# EAGLE schematic biofeedback_2560_3V (EAGLE 6.0)
DATABASE: ./BOM/PARTSDB.txt

## Sheet 1 of 4
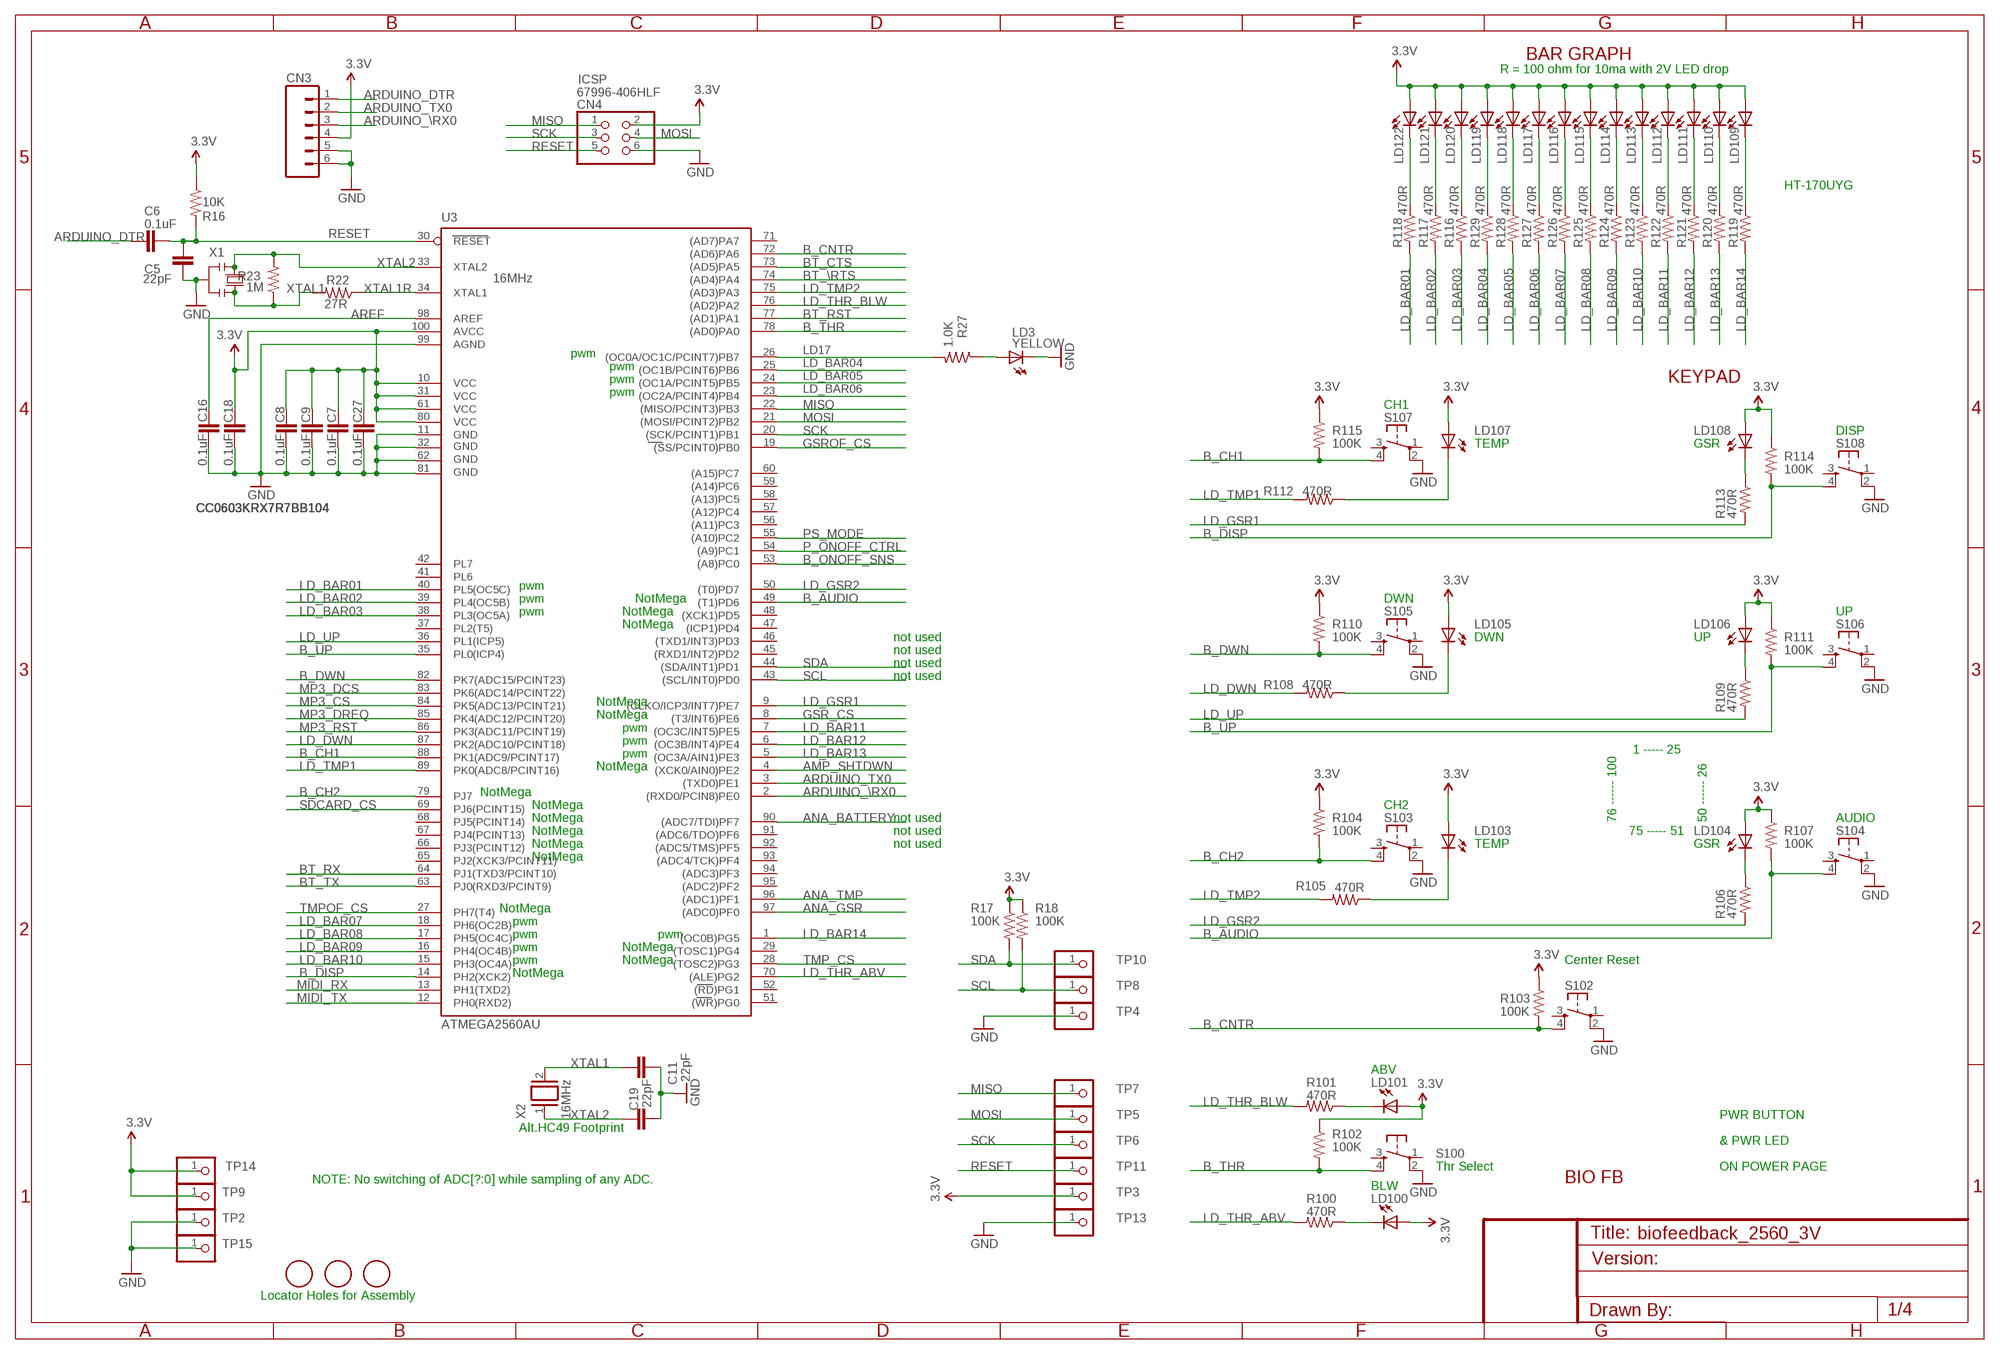
[diagram p0: schematic, sheet 1]

### Parts
C5  22pF  C-EUC0603  [C0603]
C6  0.1uF  C-EUC0603  [C0603]
C7  0.1uF  C-EUC0603  [C0603]
C8  0.1uF  C-EUC0603  [C0603]
C9  0.1uF  C-EUC0603  [C0603]
C11  22pF  C-EUC0603  [C0603]
C16  0.1uF  C-EUC0603  [C0603]
C18  0.1uF  C-EUC0603  [C0603]
C19  22pF  C-EUC0603  [C0603]
C27  0.1uF  C-EUC0603  [C0603]
CN3  NSTUFF  M06SIP  [1X06]
CN4  ICSP  PINHD-2X3  [2X03]
LD3  YELLOW  LEDCHIP-LED0805  [CHIP-LED0805]
LD100  GREEN  LEDCHIP-LED0805  [CHIP-LED0805]
LD101  GREEN  LEDCHIP-LED0805  [CHIP-LED0805]
LD103  GREEN  LEDCHIP-LED0805  [CHIP-LED0805]
LD104  GREEN  LEDCHIP-LED0805  [CHIP-LED0805]
LD105  GREEN  LEDCHIP-LED0805  [CHIP-LED0805]
LD106  GREEN  LEDCHIP-LED0805  [CHIP-LED0805]
LD107  GREEN  LEDCHIP-LED0805  [CHIP-LED0805]
LD108  GREEN  LEDCHIP-LED0805  [CHIP-LED0805]
LD109  GREEN  LEDCHIP-LED0805  [CHIP-LED0805]
LD110  GREEN  LEDCHIP-LED0805  [CHIP-LED0805]
LD111  GREEN  LEDCHIP-LED0805  [CHIP-LED0805]
LD112  GREEN  LEDCHIP-LED0805  [CHIP-LED0805]
LD113  GREEN  LEDCHIP-LED0805  [CHIP-LED0805]
LD114  GREEN  LEDCHIP-LED0805  [CHIP-LED0805]
LD115  GREEN  LEDCHIP-LED0805  [CHIP-LED0805]
LD116  GREEN  LEDCHIP-LED0805  [CHIP-LED0805]
LD117  GREEN  LEDCHIP-LED0805  [CHIP-LED0805]
LD118  GREEN  LEDCHIP-LED0805  [CHIP-LED0805]
LD119  GREEN  LEDCHIP-LED0805  [CHIP-LED0805]
LD120  GREEN  LEDCHIP-LED0805  [CHIP-LED0805]
LD121  GREEN  LEDCHIP-LED0805  [CHIP-LED0805]
LD122  GREEN  LEDCHIP-LED0805  [CHIP-LED0805]
MN1  FIDUCIALMOUNT  [FIDUCIA-MOUNT]
MN2  FIDUCIALMOUNT  [FIDUCIA-MOUNT]
MN3  FIDUCIALMOUNT  [FIDUCIA-MOUNT]
R16  10K  R-US_R0603  [R0603]
R17  100K  R-US_R0603  [R0603]
R18  100K  R-US_R0603  [R0603]
R22  27R  R-US_R0603  [R0603]
R23  1M  R-US_R0603  [R0603]
R27  1.0K  R-US_R0603  [R0603]
R100  470R  R-US_R0603  [R0603]
R101  470R  R-US_R0603  [R0603]
R102  100K  R-US_R0603  [R0603]
R103  100K  R-US_R0603  [R0603]
R104  100K  R-US_R0603  [R0603]
R105  470R  R-US_R0603  [R0603]
R106  470R  R-US_R0603  [R0603]
R107  100K  R-US_R0603  [R0603]
R108  470R  R-US_R0603  [R0603]
R109  470R  R-US_R0603  [R0603]
R110  100K  R-US_R0603  [R0603]
R111  100K  R-US_R0603  [R0603]
R112  470R  R-US_R0603  [R0603]
R113  470R  R-US_R0603  [R0603]
R114  100K  R-US_R0603  [R0603]
R115  100K  R-US_R0603  [R0603]
R116  470R  R-US_R0603  [R0603]
R117  470R  R-US_R0603  [R0603]
R118  470R  R-US_R0603  [R0603]
R119  470R  R-US_R0603  [R0603]
R120  470R  R-US_R0603  [R0603]
R121  470R  R-US_R0603  [R0603]
R122  470R  R-US_R0603  [R0603]
R123  470R  R-US_R0603  [R0603]
R124  470R  R-US_R0603  [R0603]
R125  470R  R-US_R0603  [R0603]
R126  470R  R-US_R0603  [R0603]
R127  470R  R-US_R0603  [R0603]
R128  470R  R-US_R0603  [R0603]
R129  470R  R-US_R0603  [R0603]
S100  SPST-NO  TAC_SWITCH  [TACTILE_SWITCH_SMD_6MM_SQ]
S102  SPST-NO  TAC_SWITCH  [TACTILE_SWITCH_SMD_6MM_SQ]
S103  SPST-NO  TAC_SWITCH  [TACTILE_SWITCH_SMD_6MM_SQ]
S104  SPST-NO  TAC_SWITCH  [TACTILE_SWITCH_SMD_6MM_SQ]
S105  SPST-NO  TAC_SWITCH  [TACTILE_SWITCH_SMD_6MM_SQ]
S106  SPST-NO  TAC_SWITCH  [TACTILE_SWITCH_SMD_6MM_SQ]
S107  SPST-NO  TAC_SWITCH  [TACTILE_SWITCH_SMD_6MM_SQ]
S108  SPST-NO  TAC_SWITCH  [TACTILE_SWITCH_SMD_6MM_SQ]
TP2  NSTUFF  PINHD-1X1  [1X01]
TP3  NSTUFF  PINHD-1X1  [1X01]
TP4  NSTUFF  PINHD-1X1  [1X01]
TP5  NSTUFF  PINHD-1X1  [1X01]
TP6  NSTUFF  PINHD-1X1  [1X01]
TP7  NSTUFF  PINHD-1X1  [1X01]
TP8  NSTUFF  PINHD-1X1  [1X01]
TP9  NSTUFF  PINHD-1X1  [1X01]
TP10  NSTUFF  PINHD-1X1  [1X01]
TP11  NSTUFF  PINHD-1X1  [1X01]
TP13  NSTUFF  PINHD-1X1  [1X01]
TP14  NSTUFF  PINHD-1X1  [1X01]
TP15  NSTUFF  PINHD-1X1  [1X01]
U3  ATMEGA2560AU  [TQFP100]
X1  16MHz  RESONATORMU  [RESONATOR]
X2  16MHz  XTAL/S  [QS]

### Nets
3.3V: C7.2 C8.2 C9.2 C18.2 C27.2 CN3.4 CN4.2 LD100.A LD101.A LD103.A LD104.A LD105.A LD106.A LD107.A LD108.A LD109.A LD110.A LD111.A LD112.A LD113.A LD114.A LD115.A LD116.A LD117.A LD118.A LD119.A LD120.A LD121.A LD122.A R16.1 R17.1 R18.1 R102.1 R103.1 R104.1 R107.1 R110.1 R111.1 R114.1 R115.1 TP3.1 TP9.1 TP14.1 U3.10(VCC) U3.31(VCC1) U3.61(VCC2) U3.80(VCC3) U3.100(AVCC) ; also sheet 2,3,4
AMP_SHTDWN: U3.4((XCK0/AIN0)PE2) ; also sheet 2
ANA_BATTERY: U3.90((ADC7/TDI)PF7) ; also sheet 4
ANA_GSR: U3.97((ADC0)PF0) ; also sheet 3
ANA_TMP: U3.96((ADC1)PF1) ; also sheet 3
ARDUINO_\RX0: CN3.3 U3.2((RXD0/PCIN8)PE0)
ARDUINO_DTR: C6.1 CN3.1
ARDUINO_TX0: CN3.2 U3.3((TXD0)PE1)
AREF: C16.2 U3.98(AREF)
B_AUDIO: R107.2 S104.4 U3.49((T1)PD6)
B_CH1: R115.2 S107.4 U3.88(PK1(ADC9/PCINT17))
B_CH2: R104.2 S103.4 U3.79(PJ7)
B_CNTR: R103.2 S102.4 U3.72((AD6)PA6)
B_DISP: R114.2 S108.4 U3.14(PH2(XCK2))
B_DWN: R110.2 S105.4 U3.82(PK7(ADC15/PCINT23))
B_ONOFF_SNS: U3.53((A8)PC0) ; also sheet 4
B_THR: R102.2 S100.4 U3.78((AD0)PA0)
B_UP: R111.2 S106.4 U3.35(PL0(ICP4))
BT_\RTS: U3.74((AD4)PA4) ; also sheet 2
BT_CTS: U3.73((AD5)PA5) ; also sheet 2
BT_RST: U3.77((AD1)PA1) ; also sheet 2
BT_RX: U3.64(PJ1(TXD3/PCINT10)) ; also sheet 2
BT_TX: U3.63(PJ0(RXD3/PCINT9)) ; also sheet 2
G2: LD107.C R112.1
GND: C5.2 C7.1 C8.1 C9.1 C11.1 C16.1 C18.1 C19.1 C27.1 CN3.5 CN3.6 CN4.6 LD3.C S100.2 S102.2 S103.2 S104.2 S105.2 S106.2 S107.2 S108.2 TP2.1 TP4.1 TP13.1 TP15.1 U3.11(GND) U3.32(GND1) U3.62(GND2) U3.81(GND3) U3.99(AGND) X1.2 ; also sheet 2,3,4
GSR_CS: U3.8((T3/INT6)PE6) ; also sheet 3
GSROF_CS: U3.19((SS/PCINT0)PB0) ; also sheet 3
LD17: R27.2 U3.26((OC0A/OC1C/PCINT7)PB7)
LD_BAR01: R118.2 U3.40(PL5(OC5C))
LD_BAR02: R117.2 U3.39(PL4(OC5B))
LD_BAR03: R116.2 U3.38(PL3(OC5A))
LD_BAR04: R129.2 U3.25((OC1B/PCINT6)PB6)
LD_BAR05: R128.2 U3.24((OC1A/PCINT5)PB5)
LD_BAR06: R127.2 U3.23((OC2A/PCINT4)PB4)
LD_BAR07: R126.2 U3.18(PH6(OC2B))
LD_BAR08: R125.2 U3.17(PH5(OC4C))
LD_BAR09: R124.2 U3.16(PH4(OC4B))
LD_BAR10: R123.2 U3.15(PH3(OC4A))
LD_BAR11: R122.2 U3.7((OC3C/INT5)PE5)
LD_BAR12: R121.2 U3.6((OC3B/INT4)PE4)
LD_BAR13: R120.2 U3.5((OC3A/AIN1)PE3)
LD_BAR14: R119.2 U3.1((OC0B)PG5)
LD_DWN: R108.2 U3.87(PK2(ADC10/PCINT18))
LD_GSR1: R113.2 U3.9((CLKO/ICP3/INT7)PE7)
LD_GSR2: R106.2 U3.50((T0)PD7)
LD_THR_ABV: R100.2 U3.70((ALE)PG2)
LD_THR_BLW: R101.2 U3.76((AD2)PA2)
LD_TMP1: R112.2 U3.89(PK0(ADC8/PCINT16))
LD_TMP2: R105.2 U3.75((AD3)PA3)
LD_UP: R109.2 U3.36(PL1(ICP5))
MIDI_RX: U3.13(PH1(TXD2)) ; also sheet 2
MIDI_TX: U3.12(PH0(RXD2)) ; also sheet 2
MISO: CN4.1 TP7.1 U3.22((MISO/PCINT3)PB3) ; also sheet 2
MOSI: CN4.4 TP5.1 U3.21((MOSI/PCINT2)PB2) ; also sheet 2,3
MP3_CS: U3.84(PK5(ADC13/PCINT21)) ; also sheet 2
MP3_DCS: U3.83(PK6(ADC14/PCINT22)) ; also sheet 2
MP3_DREQ: U3.85(PK4(ADC12/PCINT20)) ; also sheet 2
MP3_RST: U3.86(PK3(ADC11/PCINT19)) ; also sheet 2
N$14: LD105.C R108.1
N$21: LD106.C R109.1
N$23: LD122.C R118.1
N$24: LD121.C R117.1
N$25: LD120.C R116.1
N$26: LD119.C R129.1
N$28: LD118.C R128.1
N$29: LD117.C R127.1
N$30: LD116.C R126.1
N$31: LD115.C R125.1
N$32: LD114.C R124.1
N$33: LD113.C R123.1
N$34: LD112.C R122.1
N$35: LD111.C R121.1
N$36: LD110.C R120.1
N$37: LD109.C R119.1
N$57: LD103.C R105.1
N$58: LD104.C R106.1
N$61: LD101.C R101.1
N$63: LD100.C R100.1
N$73: LD108.C R113.1
N$77: LD3.A R27.1
P_ONOFF_CTRL: U3.54((A9)PC1) ; also sheet 4
PS_MODE: U3.55((A10)PC2) ; also sheet 4
RESET: C5.1 C6.2 CN4.5 R16.2 TP11.1 U3.30(RESET)
SCK: CN4.3 TP6.1 U3.20((SCK/PCINT1)PB1) ; also sheet 2,3
SCL: R18.2 TP8.1 U3.43((SCL/INT0)PD0)
SDA: R17.2 TP10.1 U3.44((SDA/INT1)PD1)
SDCARD_CS: U3.69(PJ6(PCINT15)) ; also sheet 2
TMP_CS: U3.28((TOSC2)PG3) ; also sheet 3
TMPOF_CS: U3.27(PH7(T4)) ; also sheet 3
XTAL1: C11.2 R22.2 R23.1 X1.3 X2.2
XTAL1R: R22.1 U3.34(XTAL1)
XTAL2: C19.2 R23.2 U3.33(XTAL2) X1.1 X2.1
Unconnected: S100.1 S100.3 S102.1 S102.3 S103.1 S103.3 S104.1 S104.3 S105.1 S105.3 S106.1 S106.3 S107.1 S107.3 S108.1 S108.3 U3.29((TOSC1)PG4) U3.37(PL2(T5)) U3.41(PL6) U3.42(PL7) U3.45((RXD1/INT2)PD2) U3.46((TXD1/INT3)PD3) U3.47((ICP1)PD4) U3.48((XCK1)PD5) U3.51((WR)PG0) U3.52((RD)PG1) U3.56((A11)PC3) U3.57((A12)PC4) U3.58((A13)PC5) U3.59((A14)PC6) U3.60((A15)PC7) U3.65(PJ2(XCK3/PCINT11)) U3.66(PJ3(PCINT12)) U3.67(PJ4(PCINT13)) U3.68(PJ5(PCINT14)) U3.71((AD7)PA7) U3.91((ADC6/TDO)PF6) U3.92((ADC5/TMS)PF5) U3.93((ADC4/TCK)PF4) U3.94((ADC3)PF3) U3.95((ADC2)PF2)

### Notes on the sheet
- BAR GRAPH
- R = 100 ohm for 10ma with 2V LED drop
- HT-170UYG
- pwm
- pwm
- pwm | KEYPAD
- pwm
- CH1
- DISP
- TEMP | GSR
- pwm
- pwm | NotMega | DWN
- pwm | NotMega | UP
- NotMega
- not used | DWN | UP
- not used
- not used
- not used
- NotMega
- NotMega
- pwm
- pwm | 1 ----- 25
- pwm
- NotMega
- NotMega
- NotMega | CH2
- NotMega | not used | 76 ------ 100 | 50 ------ 26 | AUDIO
- NotMega | not used | 75 ----- 51
- NotMega | not used | TEMP | GSR
- NotMega
- NotMega
- pwm
- pwm | pwm
- pwm | NotMega
- pwm | NotMega | Center Reset
- NotMega
- ABV
- PWR BUTTON
- Alt.HC49 Footprint
- & PWR LED
- Thr Select | ON POWER PAGE
- NOTE: No switching of ADC[?:0] while sampling of any ADC. | BIO FB
- BLW
- Locator Holes for Assembly

## Sheet 2 of 4
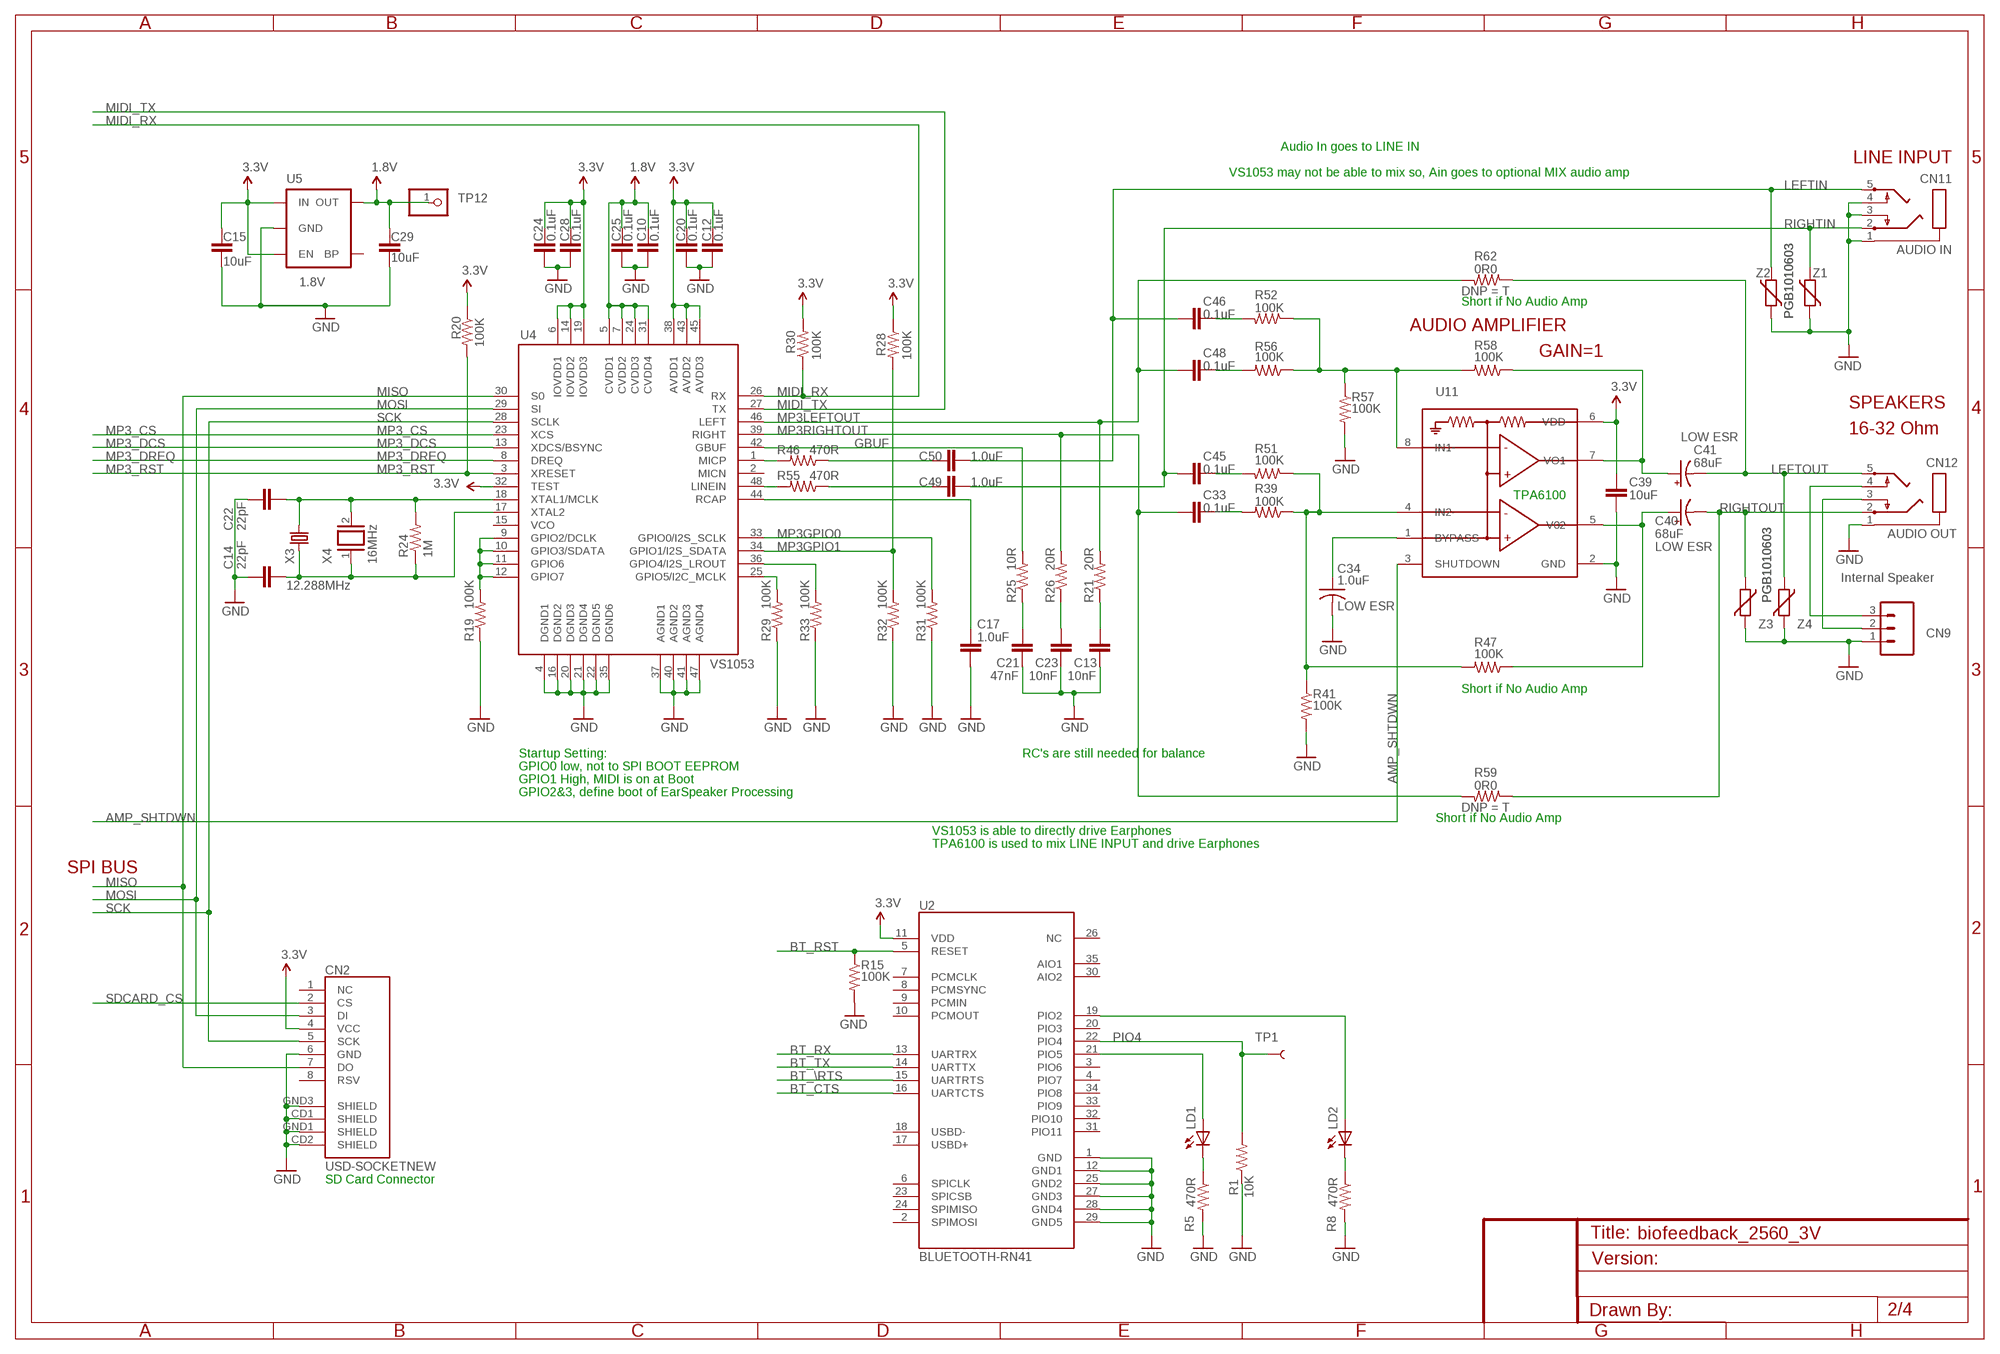
[diagram p1: schematic, sheet 2]

### Parts
C10  0.1uF  C-EUC0603  [C0603]
C12  0.1uF  C-EUC0603  [C0603]
C13  10nF  C-EUC0603  [C0603]
C14  22pF  C-EUC0603  [C0603]
C15  10uF  C-EUC0603  [C0603]
C17  1.0uF  C-EUC0603  [C0603]
C20  0.1uF  C-EUC0603  [C0603]
C21  47nF  C-EUC0603  [C0603]
C22  22pF  C-EUC0603  [C0603]
C23  10nF  C-EUC0603  [C0603]
C24  0.1uF  C-EUC0603  [C0603]
C25  0.1uF  C-EUC0603  [C0603]
C28  0.1uF  C-EUC0603  [C0603]
C29  10uF  C-EUC0603  [C0603]
C33  0.1uF  C-EUC0603  [C0603]
C34  1.0uF  C-USC0805  [C0805]
C39  10uF  C-EUC0603  [C0603]
C40  68uF  CPOL-USCT7343  [CT7343]
C41  68uF  CPOL-USCT7343  [CT7343]
C45  0.1uF  C-EUC0603  [C0603]
C46  0.1uF  C-EUC0603  [C0603]
C48  0.1uF  C-EUC0603  [C0603]
C49  1.0uF  C-EUC0603  [C0603]
C50  1.0uF  C-EUC0603  [C0603]
CN2  USD-SOCKETNEW  [MICRO-SD-SOCKET-PP]
CN9  Internal Speaker  M03PTH  [1X03]
CN11  AUDIO IN  STEREOJACK  [STX3100]
CN12  AUDIO OUT  STEREOJACK  [STX3100]
LD1  GREEN  LEDCHIP-LED0805  [CHIP-LED0805]
LD2  GREEN  LEDCHIP-LED0805  [CHIP-LED0805]
R1  10K  R-US_R0603  [R0603]
R5  470R  R-US_R0603  [R0603]
R8  470R  R-US_R0603  [R0603]
R15  100K  R-US_R0603  [R0603]
R19  100K  R-US_R0603  [R0603]
R20  100K  R-US_R0603  [R0603]
R21  20R  R-US_R0603  [R0603]
R24  1M  R-US_R0603  [R0603]
R25  10R  R-US_R0603  [R0603]
R26  20R  R-US_R0603  [R0603]
R28  100K  R-US_R0603  [R0603]
R29  100K  R-US_R0603  [R0603]
R30  100K  R-US_R0603  [R0603]
R31  100K  R-US_R0603  [R0603]
R32  100K  R-US_R0603  [R0603]
R33  100K  R-US_R0603  [R0603]
R39  100K  R-US_R0603  [R0603]
R41  100K  R-US_R0603  [R0603]
R46  470R  R-US_R0603  [R0603]
R47  100K  R-US_R0603  [R0603]
R51  100K  R-US_R0603  [R0603]
R52  100K  R-US_R0603  [R0603]
R55  470R  R-US_R0603  [R0603]
R56  100K  R-US_R0603  [R0603]
R57  100K  R-US_R0603  [R0603]
R58  100K  R-US_R0603  [R0603]
R59  0R0  R-US_R0603  [R0603]
R62  0R0  R-US_R0603  [R0603]
TP1  TEST-POINT3X5  [PAD.03X.05]
TP12  NSTUFF  PINHD-1X1  [1X01]
U2  BLUETOOTH-RN41  BLUETOOTH-RN41"  [RN41]
U4  VS1053  VS1033  [LQFP-48]
U5  1.8V  V_REG_LDOSMD2  [SC70]
U11  TPA6100  [SO-08]
X3  12.288MHz  CRYSTAL5X3  [CRYSTAL-SMD-5X3]
X4  16MHz  XTAL/S  [QS_COMBO]
Z1  PGB1010603  VARISTORCN0603  [CT/CN0603]
Z2  PGB1010603  VARISTORCN0603  [CT/CN0603]
Z3  PGB1010603  VARISTORCN0603  [CT/CN0603]
Z4  PGB1010603  VARISTORCN0603  [CT/CN0603]

### Nets
1.8V [power]: C10.1 C25.1 C29.1 TP12.1 U4.5(CVDD1) U4.7(CVDD2) U4.24(CVDD3) U4.31(CVDD4) U5.5(OUT)
3.3V: C12.1 C15.1 C20.1 C24.1 C28.1 C39.1 CN2.4(VCC) R20.1 R28.1 R30.2 U2.11(VDD) U4.6(IOVDD1) U4.14(IOVDD2) U4.19(IOVDD3) U4.32(TEST) U4.38(AVDD1) U4.43(AVDD2) U4.45(AVDD3) U5.1(IN) U5.3(EN) U11.6(VDD) ; also sheet 1,3,4
AMP_SHTDWN: U11.3(SHUTDOWN) ; also sheet 1
BT_\RTS: U2.15(UARTRTS) ; also sheet 1
BT_CTS: U2.16(UARTCTS) ; also sheet 1
BT_RST: R15.1 U2.5(RESET) ; also sheet 1
BT_RX: U2.13(UARTRX) ; also sheet 1
BT_TX: U2.14(UARTTX) ; also sheet 1
D1: LD1.C R5.1
D2: LD2.C R8.1
GBUF: R25.2 U4.42(GBUF)
GND: C10.2 C12.2 C13.2 C14.1 C15.2 C17.1 C20.2 C21.2 C22.1 C23.2 C24.2 C25.2 C28.2 C29.2 C34.2 C39.2 CN2.6(GND) CN2.CD1(SHIELD) CN2.CD2(SHIELD) CN2.GND1(SHIELD) CN2.GND3(SHIELD) CN9.1 CN11.1 CN11.3 CN11.4 CN12.1 R1.1 R5.2 R8.2 R15.2 R19.1 R29.1 R31.1 R32.1 R33.1 R41.2 R57.2 U2.1(GND) U2.12(GND1) U2.25(GND2) U2.27(GND3) U2.28(GND4) U2.29(GND5) U4.4(DGND1) U4.16(DGND2) U4.20(DGND3) U4.21(DGND4) U4.22(DGND5) U4.35(DGND6) U4.37(AGND1) U4.40(AGND2) U4.41(AGND3) U4.47(AGND4) U5.2(GND) U11.2(GND) Z1.2 Z2.2 Z3.2 Z4.2 ; also sheet 1,3,4
LEFTIN: C46.1 C50.1 CN11.5 Z2.1
LEFTOUT: C41.- CN12.5 R62.1 Z4.1
LEFTOUTSPKR: CN9.3 CN12.4
MIDI_RX: R30.1 U4.26(RX) ; also sheet 1
MIDI_TX: U4.27(TX) ; also sheet 1
MISO: CN2.7(DO) U4.30(S0) ; also sheet 1
MOSI: CN2.3(DI) U4.29(SI) ; also sheet 1,3
MP3_CS: U4.23(XCS) ; also sheet 1
MP3_DCS: U4.13(XDCS/BSYNC) ; also sheet 1
MP3_DREQ: U4.8(DREQ) ; also sheet 1
MP3_RST: R20.2 U4.3(XRESET) ; also sheet 1
MP3GPIO0: R31.2 U4.33(GPIO0/I2S_SCLK)
MP3GPIO1: R28.2 R32.2 U4.34(GPIO1/I2S_SDATA)
MP3LEFTOUT: C48.1 R21.2 R62.2 U4.46(LEFT)
MP3LINEINLEFT: R46.2 U4.1(MICP)
MP3LINEINRIGHT: R55.2 U4.48(LINEIN)
MP3RCAP: C17.2 U4.44(RCAP)
MP3RIGHTOUT: C33.1 R26.2 R59.2 U4.39(RIGHT)
N$2: R52.1 R56.1 R57.1 R58.2 U11.8(IN1-)
N$4: C21.1 R25.1
N$5: C13.1 R21.1
N$6: C46.2 R52.2
N$7: C23.1 R26.1
N$8: R39.1 R41.1 R47.2 R51.1 U11.4(IN2-)
N$10: C14.2 R24.1 U4.17(XTAL2) X3.1 X4.1
N$38: C45.2 R51.2
N$39: C41.+ R58.1 U11.7(VO1)
N$40: C40.+ R47.1 U11.5(V02)
N$43: C48.2 R56.2
N$44: C33.2 R39.2
N$45: C34.1 U11.1(BYPASS)
N$47: LD1.A U2.21(PIO5)
N$51: R19.2 U4.9(GPIO2/DCLK) U4.10(GPIO3/SDATA) U4.11(GPIO6) U4.12(GPIO7)
N$52: LD2.A U2.19(PIO2)
N$54: R33.2 U4.36(GPIO4/I2S_LROUT)
N$60: R29.2 U4.25(GPIO5/I2C_MCLK)
N$62: C50.2 R46.1
N$64: C49.2 R55.1
N$66: C22.2 R24.2 U4.18(XTAL1/MCLK) X3.3 X4.2
PIO4: R1.2 TP1.P$1 U2.22(PIO4)
RIGHTIN: C45.1 C49.1 CN11.2 Z1.1
RIGHTOUT: C40.- CN12.2 R59.1 Z3.1
RIGHTOUTSPKR: CN9.2 CN12.3
SCK: CN2.5(SCK) U4.28(SCLK) ; also sheet 1,3
SDCARD_CS: CN2.2(CS) ; also sheet 1
Unconnected: CN2.1(NC) CN2.8(RSV) U2.2(SPIMOSI) U2.3(PIO6) U2.4(PIO7) U2.6(SPICLK) U2.7(PCMCLK) U2.8(PCMSYNC) U2.9(PCMIN) U2.10(PCMOUT) U2.17(USBD+) U2.18(USBD-) U2.20(PIO3) U2.23(SPICSB) U2.24(SPIMISO) U2.26(NC) U2.30(AIO2) U2.31(PIO11) U2.32(PIO10) U2.33(PIO9) U2.34(PIO8) U2.35(AIO1) U4.2(MICN) U4.15(VCO) U5.4(BP)

### Notes on the sheet
- Audio In goes to LINE IN
- LINE INPUT
- VS1053 may not be able to mix so, Ain goes to optional MIX audio amp
- Short if No Audio Amp
- AUDIO AMPLIFIER
- GAIN=1
- SPEAKERS
- 16-32 Ohm
- TPA6100
- Short if No Audio Amp
- Startup Setting: | RC's are still needed for balance
- GPIO0 low, not to SPI BOOT EEPROM
- GPIO1 High, MIDI is on at Boot
- GPIO2&3, define boot of EarSpeaker Processing
- Short if No Audio Amp
- VS1053 is able to directly drive Earphones
- TPA6100 is used to mix LINE INPUT and drive Earphones
- SPI BUS
- SD Card Connector

## Sheet 3 of 4
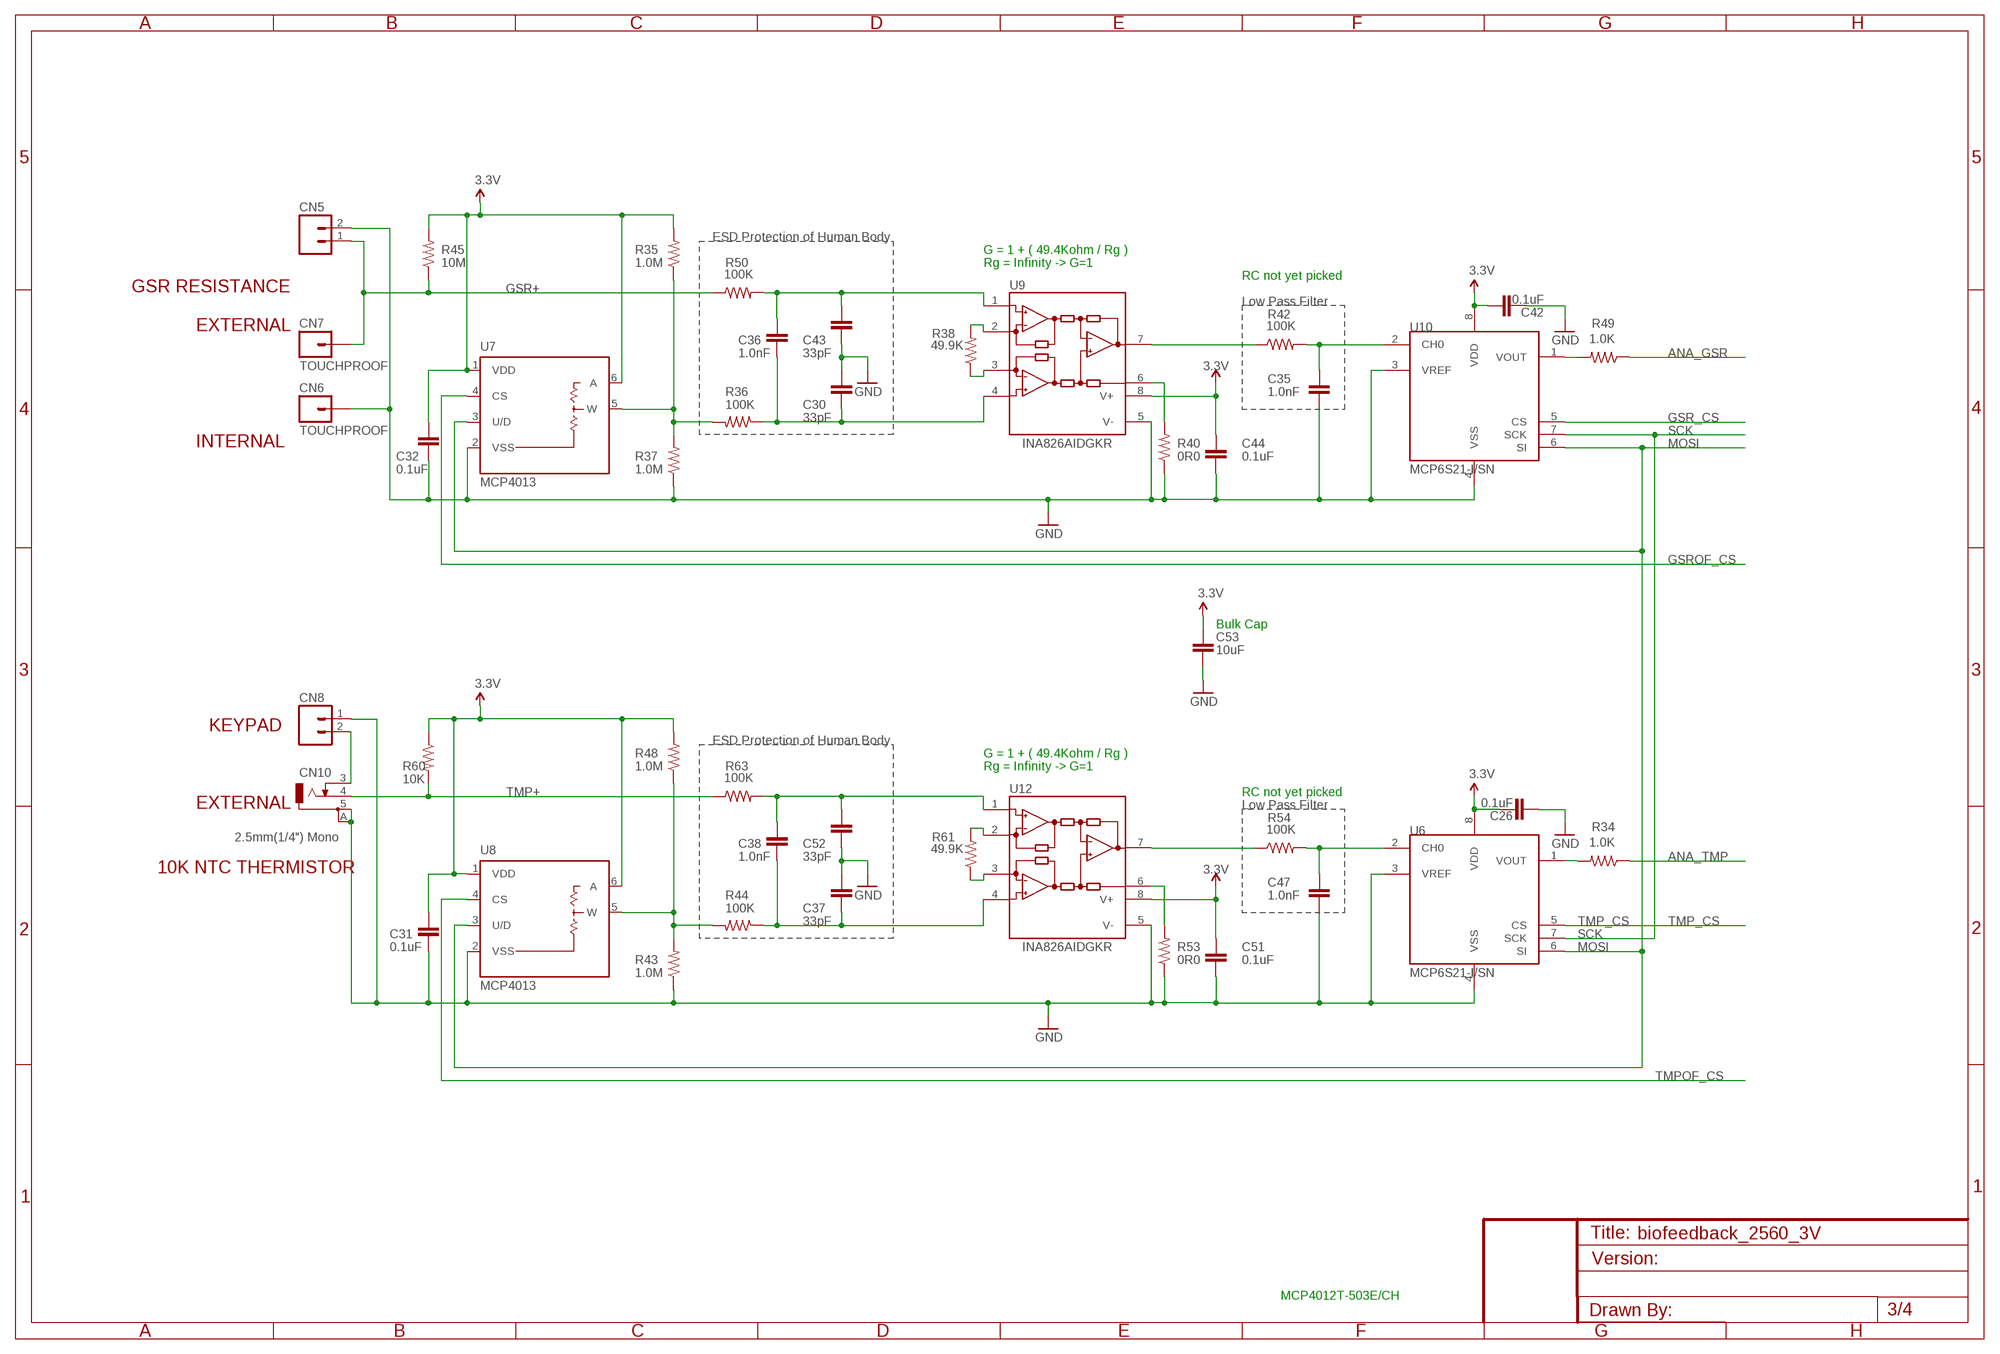
[diagram p2: schematic, sheet 3]

### Parts
C26  0.1uF  C-EUC0603  [C0603]
C30  33pF  C-EUC0603  [C0603]
C31  0.1uF  C-EUC0603  [C0603]
C32  0.1uF  C-EUC0603  [C0603]
C35  1.0nF  C-EUC0603  [C0603]
C36  1.0nF  C-EUC0603  [C0603]
C37  33pF  C-EUC0603  [C0603]
C38  1.0nF  C-EUC0603  [C0603]
C42  0.1uF  C-EUC0603  [C0603]
C43  33pF  C-EUC0603  [C0603]
C44  0.1uF  C-EUC0603  [C0603]
C47  1.0nF  C-EUC0603  [C0603]
C51  0.1uF  C-EUC0603  [C0603]
C52  33pF  C-EUC0603  [C0603]
C53  10uF  C-EUC0603  [C0603]
CN5  CONN HEADER PH TOP 2POS 2MM  M02PTH  [1X02]
CN6  TOUCHPROOF  [TOUCHPROOF1.1MM]
CN7  TOUCHPROOF  [TOUCHPROOF1.1MM]
CN8  CONN HEADER PH TOP 2POS 2MM  M02PTH  [1X02]
CN10  2.5mm(1/4") Mono  AUDIOJACK2.5MM_MONO_SWITCH  [STEREOJACK2.5MM_SMD]
R34  1.0K  R-US_R0603  [R0603]
R35  1.0M  R-US_R0603  [R0603]
R36  100K  R-US_R0603  [R0603]
R37  1.0M  R-US_R0603  [R0603]
R38  49.9K  R-US_R0603  [R0603]
R40  0R0  R-US_R0603  [R0603]
R42  100K  R-US_R0603  [R0603]
R43  1.0M  R-US_R0603  [R0603]
R44  100K  R-US_R0603  [R0603]
R45  10M  R-US_R0603  [R0603]
R48  1.0M  R-US_R0603  [R0603]
R49  1.0K  R-US_R0603  [R0603]
R50  100K  R-US_R0603  [R0603]
R53  0R0  R-US_R0603  [R0603]
R54  100K  R-US_R0603  [R0603]
R60  10K  R-US_R0603  [R0603]
R61  49.9K  R-US_R0603  [R0603]
R63  100K  R-US_R0603  [R0603]
U6  MCP6S21-I/SN  MCP6S21  [SO-08]
U7  MCP4013  [SOT-23-6]
U8  MCP4013  [SOT-23-6]
U9  INA826  [MSOP-8]
U10  MCP6S21-I/SN  MCP6S21  [SO-08]
U12  INA826  [MSOP-8]

### Nets
3.3V: C26.1 C31.1 C32.1 C42.1 C44.1 C51.1 C53.1 R35.2 R45.2 R48.2 R60.1 U6.8(VDD) U7.1(VDD) U7.6(A) U8.1(VDD) U8.6(A) U9.8(V+) U10.8(VDD) U12.8(V+) ; also sheet 1,2,4
ANA_GSR: R49.1 ; also sheet 1
ANA_TMP: R34.1 ; also sheet 1
GND: C26.2 C30.1 C31.2 C32.2 C35.2 C37.1 C42.2 C43.2 C44.2 C47.2 C51.2 C52.2 C53.2 CN5.2 CN6.P$1 CN8.1 CN10.5 CN10.A R37.1 R40.1 R43.1 R53.1 U6.3(VREF) U6.4(VSS) U7.2(VSS) U8.2(VSS) U9.5(V-) U10.3(VREF) U10.4(VSS) U12.5(V-) ; also sheet 1,2,4
GSR+: CN5.1 CN7.P$1 R45.1 R50.1
GSR_CS: U10.5(CS) ; also sheet 1
GSROF_CS: U7.4(CS) ; also sheet 1
MOSI: U6.6(SI) U7.3(U/D) U8.3(U/D) U10.6(SI) ; also sheet 1,2
N$11: R38.2 U9.2(RG)
N$15: R38.1 U9.3(RG)
N$16: C30.2 C36.2 R36.1 U9.4(+IN)
N$17: C36.1 C43.1 R50.2 U9.1(-IN)
N$18: R42.1 U9.7(OUT)
N$22: C35.1 R42.2 U10.2(CH0)
N$41: R61.2 U12.2(RG)
N$42: R61.1 U12.3(RG)
N$46: C38.1 C52.1 R63.2 U12.1(-IN)
N$48: C37.2 C38.2 R44.1 U12.4(+IN)
N$49: R54.1 U12.7(OUT)
N$50: C47.1 R54.2 U6.2(CH0)
N$55: R53.2 U12.6(REF)
N$59: R34.2 U6.1(VOUT)
N$65: R43.2 R44.2 R48.1 U8.5(W)
N$68: CN8.2 CN10.3
N$70: R35.1 R36.2 R37.2 U7.5(W)
N$72: R49.2 U10.1(VOUT)
N$78: R40.2 U9.6(REF)
SCK: U6.7(SCK) U10.7(SCK) ; also sheet 1,2
TMP+: CN10.4 R60.2 R63.1
TMP_CS: U6.5(CS) ; also sheet 1
TMPOF_CS: U8.4(CS) ; also sheet 1

### Notes on the sheet
- ESD Protection of Human Body
- G = 1 + ( 49.4Kohm / Rg )
- Rg = Infinity -> G=1
- RC not yet picked
- GSR RESISTANCE
- Low Pass Filter
- EXTERNAL
- INTERNAL
- Bulk Cap
- KEYPAD
- ESD Protection of Human Body
- G = 1 + ( 49.4Kohm / Rg )
- Rg = Infinity -> G=1
- RC not yet picked
- EXTERNAL | Low Pass Filter
- 10K NTC THERMISTOR
- MCP4012T-503E/CH

## Sheet 4 of 4
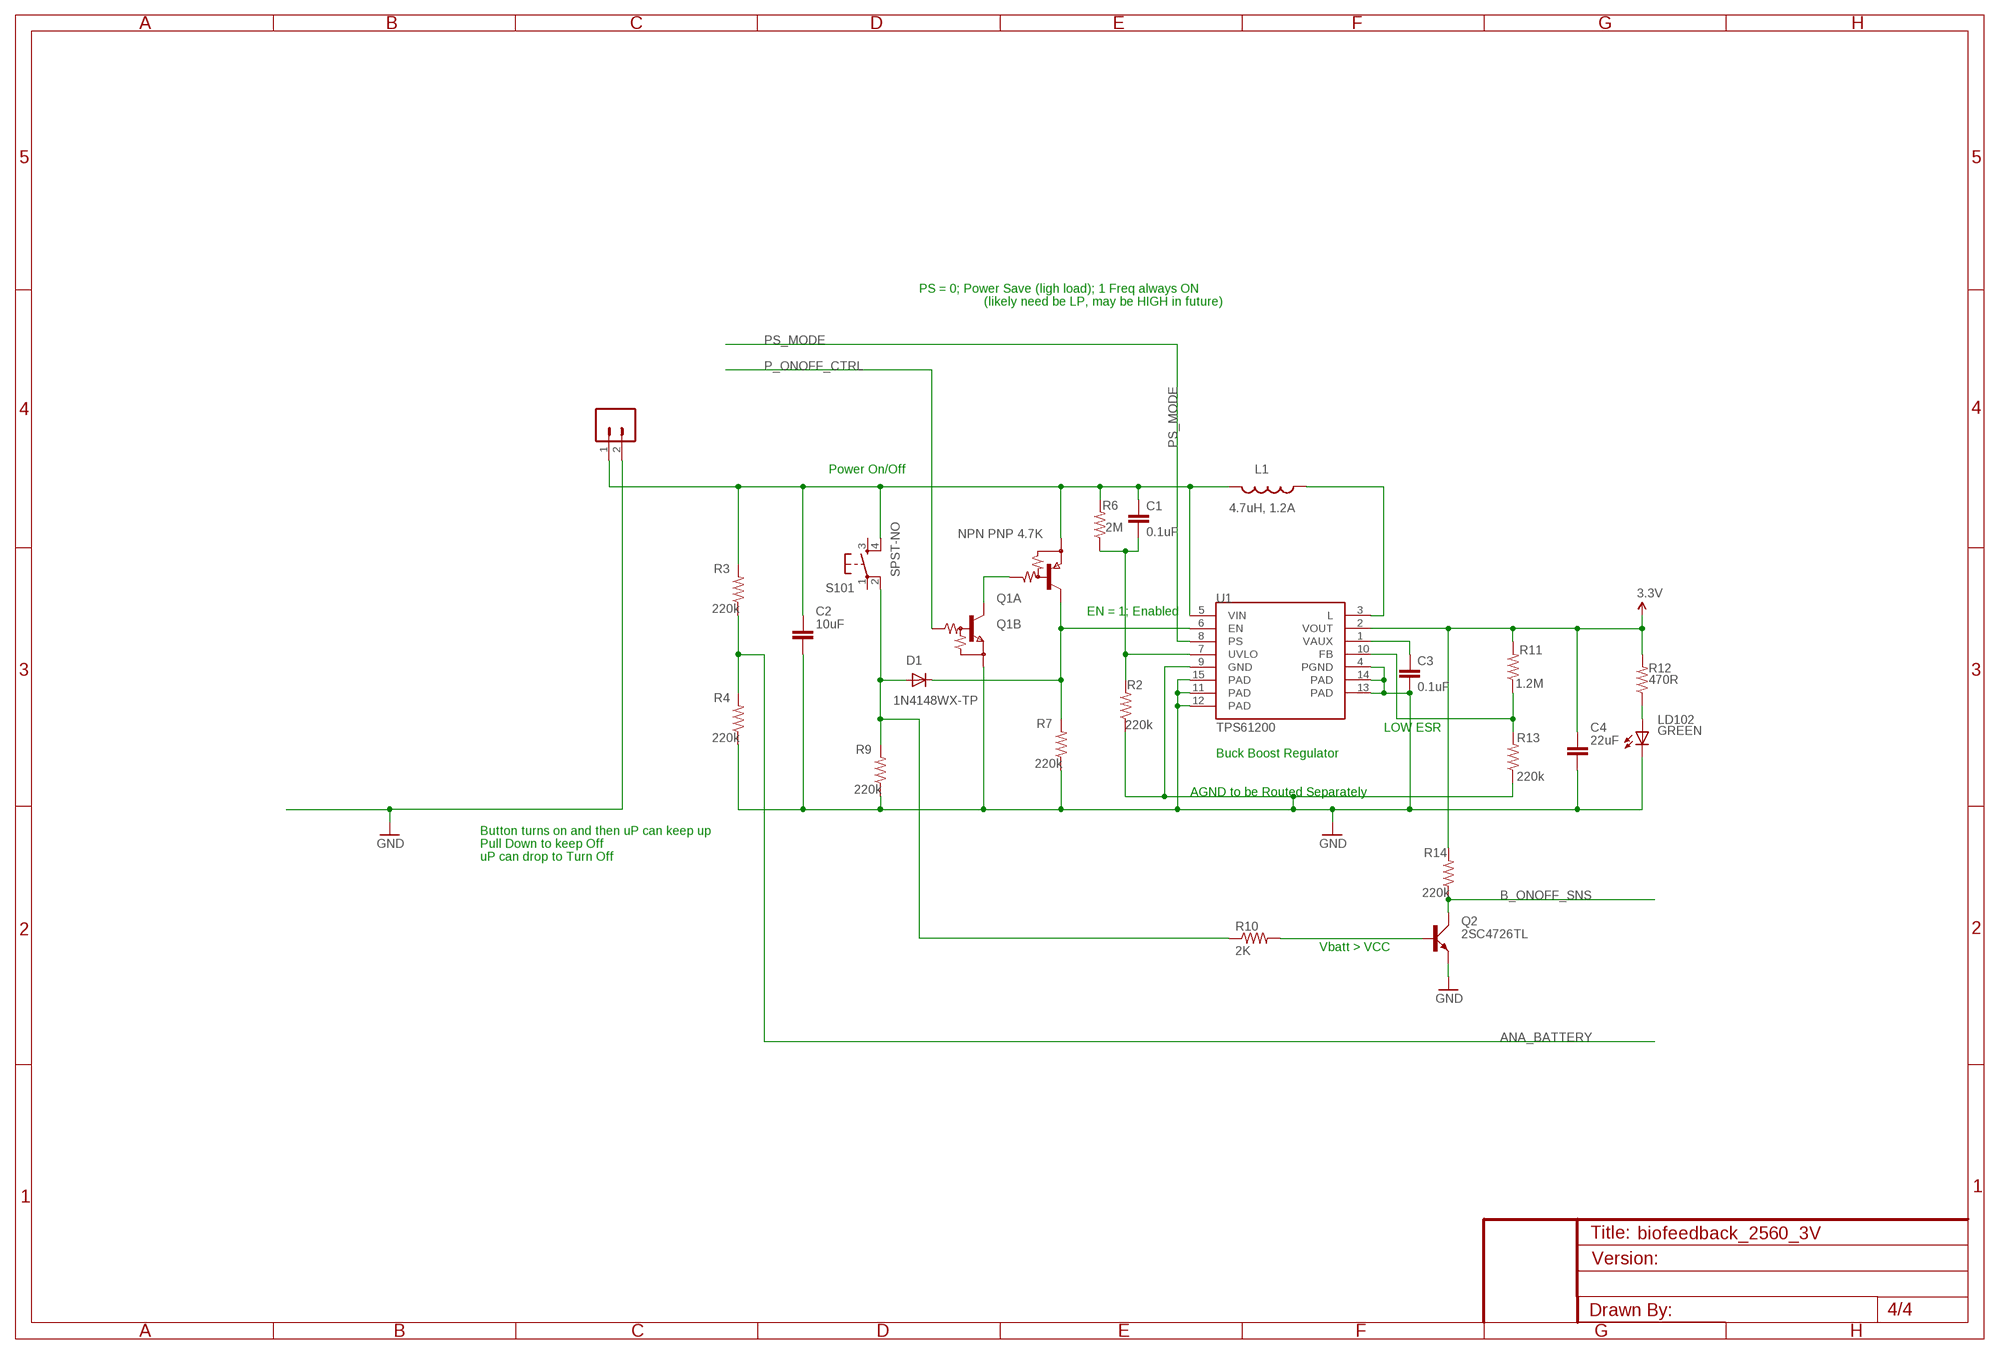
[diagram p3: schematic, sheet 4]

### Parts
C1  0.1uF  C-EUC0603  [C0603]
C2  10uF  C-EUC0603  [C0603]
C3  0.1uF  C-EUC0603  [C0603]
C4  22uF  C-EUC0603  [C0603]
CN1  CONN HEADER PH TOP 2POS 2MM  M02PTH  [1X02]
D1  1N4148WX-TP  DIODE-SOD323-R  [SOD323-R]
L1  4.7uH, 1.2A  INDUCTOR.  [CDRH2D09]
LD102  GREEN  LEDCHIP-LED0805  [CHIP-LED0805]
Q1  NPN PNP 4.7K  NPN_PNPSM8  [SOT-23-6]
Q2  2SC4726TL  [EMT3]
R2  220k  R-US_R0603  [R0603]
R3  220k  R-US_R0603  [R0603]
R4  220k  R-US_R0603  [R0603]
R6  2M  R-US_R0603  [R0603]
R7  220k  R-US_R0603  [R0603]
R9  220k  R-US_R0603  [R0603]
R10  2K  R-US_R0603  [R0603]
R11  1.2M  R-US_R0603  [R0603]
R12  470R  R-US_R0603  [R0603]
R13  220k  R-US_R0603  [R0603]
R14  220k  R-US_R0603  [R0603]
S101  SPST-NO  TAC_SWITCH  [TACTILE_SWITCH_SMD_6MM_SQ]
U1  TPS61200  [QFN-10_PAD]

### Nets
3.3V: C4.1 R11.2 R12.2 R14.2 U1.2(VOUT) ; also sheet 1,2,3
ANA_BATTERY: R3.1 R4.2 ; also sheet 1
B_ONOFF_SNS: Q2.C R14.1 ; also sheet 1
FB: R11.1 R13.2 U1.10(FB)
GND: C2.2 C3.2 C4.2 CN1.2 LD102.C Q1.1(B:E) Q2.E R2.1 R4.1 R7.1 R9.1 R13.1 U1.4(PGND) U1.9(GND) U1.11(PAD) U1.12(PAD) U1.13(PAD) U1.14(PAD) U1.15(PAD) ; also sheet 1,2,3
N$3: LD102.A R12.1
N$13: Q1.5(A:B) Q1.6(B:C)
N$19: L1.P$1 U1.3(L)
N$20: C3.1 U1.1(VAUX)
N$27: D1.C Q1.3(A:C) R7.2 U1.6(EN)
N$56: D1.A R9.2 R10.1 S101.2
N$71: Q2.B R10.2
P_ONOFF_CTRL: Q1.2(B:B) ; also sheet 1
PS_MODE: U1.8(PS) ; also sheet 1
UVLO: C1.2 R2.2 R6.1 U1.7(UVLO)
VIN: C1.1 C2.1 CN1.1 L1.P$2 Q1.4(A:E) R3.2 R6.2 S101.4 U1.5(VIN)
Unconnected: S101.1 S101.3

### Notes on the sheet
- PS = 0; Power Save (ligh load); 1 Freq always ON
- (likely need be LP, may be HIGH in future)
- Power On/Off
- EN = 1; Enabled
- LOW ESR
- Buck Boost Regulator
- AGND to be Routed Separately
- Button turns on and then uP can keep up
- Pull Down to keep Off
- uP can drop to Turn Off
- Vbatt > VCC

## Library data of the parts
C1 C3 C6-C9 C12 C16 C18 C20 C25 C27 C28 C31-C33 C42 C44-C46 C48 C51 = resistor:C-EU: CAPACITOR, European symbol; PARTNO: CC0603KRX7R7BB104
C2 C15 C29 C39 C53 = resistor:C-EU: CAPACITOR, European symbol; PARTNO: C1608X5R1A106M
C4 = resistor:C-EU: CAPACITOR, European symbol; PARTNO: 250R14W224KV4T
C5 C14 C22 = resistor:C-EU: CAPACITOR, European symbol; PARTNO: GRM0335C1E220JD01D
C10 C24 C26 = mpf:C-EU: CAPACITOR, European symbol; PARTNO: CC0603KRX7R7BB104
C11 C19 = resistor:C-EU: CAPACITOR, European symbol; PARTNO: GRM0335C1E220JD01D; PLACE: POP IF X3
C13 C23 = resistor:C-EU: CAPACITOR, European symbol; PARTNO: CC0603KRX7R9BB103
C17 C49 C50 = resistor:C-EU: CAPACITOR, European symbol; PARTNO: GRM188R61A105KA61D
C21 = resistor:C-EU: CAPACITOR, European symbol; PARTNO: CC0603KRX7R8BB473
C30 C37 C43 C52 = resistor:C-EU: CAPACITOR, European symbol; DNP: T; PARTNO: GRM0335C1E330JD01D
C34 = rcl:C-US: CAPACITOR, American symbol; ESR: LOW ESR; PARTNO: ECP-U1C104MA5
C35 C36 C38 C47 = resistor:C-EU: CAPACITOR, European symbol; DNP: T; PARTNO: CC0603KRX7R9BB102
C40 C41 = rcl:CPOL-US: POLARIZED CAPACITOR, American symbol; ESR: LOW ESR; PARTNO: T491C686K006AT
CN1 CN5 CN8 = SparkFun:M02: Header 2 Standard 2-pin 0.1" header. Use with straight break away headers (SKU : PRT-00116), right angle break away headers (PRT-00553), swiss pins (PRT-00743), machine pins (PRT-00117), and female headers (PRT-00115). Molex polarized connector foot print use with SKU : PRT-08233 with associated crimp pins and housings.; PARTNO: B2B-PH-K-S(LF)(SN)
CN2 = SparkFun:USD-SOCKET: microSD Socket Push-push type uSD socket. Schematic element and footprint production proven. Spark Fun Electronics SKU : PRT-00127. tDoc lines correctly indicate media card edge positions when inserting (unlocked, locked, depressed).; PARTNO: 101-00581-59
CN3 = SparkFun:M06: Header 6 Standard 6-pin 0.1" header. Use with straight break away headers (SKU : PRT-00116), right angle break away headers (PRT-00553), swiss pins (PRT-00743), machine pins (PRT-00117), and female headers (PRT-00115). Molex polarized connector foot print use with SKU : PRT-08094 with associated crimp pins and housings. NOTES ON THE VARIANTS LOCK and LOCK_LONGPADS... This footprint was designed to help hold the alignment of a through-hole component (i.e. 6-pin header) while soldering it into place. You may notice that each hole has been shifted either up or down by 0.005 of an inch from it's more standard position (which is a perfectly straight line). This slight alteration caused the pins (the squares in the middle) to touch the edges of the holes. Because they are alternating, it causes a "brace" to hold the component in place. 0.005 has proven to be the perfect amount of "off-center" position when using our standard breakaway headers. Although looks a little odd when you look at the bare footprint, once you have a header in there, the alteration is very hard to notice. Also, if you push a header all the way into place, it is covered up entirely on the bottom side. This idea of altering the position of holes to aid alignment will be further integrated into the Sparkfun Library for other footprints. It can help hold any component with 3 or more connection pins.; PARTNO: 640456-6
CN4 = pinhead:PINHD-2X3: PIN HEADER; PARTNO: 67996-406HLF
CN6 CN7 = mpf:TOUCHPROOF: Header 1 Standard 1-pin 0.1" header. Use with straight break away headers (SKU : PRT-00116), right angle break away headers (PRT-00553), swiss pins (PRT-00743), machine pins (PRT-00117), and female headers (PRT-00115).; PARTNO: 36619
CN9 = SparkFun:M03: Header 3 Standard 3-pin 0.1" header. Use with straight break away headers (SKU : PRT-00116), right angle break away headers (PRT-00553), swiss pins (PRT-00743), machine pins (PRT-00117), and female headers (PRT-00115). Molex polarized connector foot print use with SKU : PRT-08232 with associated crimp pins and housings.; PARTNO: 640454-3
CN10 = mpf:AUDIOJACK2.5MM_MONO_SWITCH: Audio JACK Source: "Audio Jack 2.5mm Mono w Switch - MDSMT2ARATRX.pdf"; PARTNO: MDSMT2ARATRX
CN11 = adafruit:STEREOJACK: MIC/HEADPHONE JACK Stereo jack with two switches. Kycon STX3100, CUI SJ1-3555NG and/or 4UCon 05544; PARTNO: SJ1-3555NG-BE
CN12 = adafruit:STEREOJACK: MIC/HEADPHONE JACK Stereo jack with two switches. Kycon STX3100, CUI SJ1-3555NG and/or 4UCon 05544; PARTNO: SJ1-3555NG-GR
D1 = diode:DIODE-: DIODE; PARTNO: 1N4148WX-TP
L1 = SparkFun:INDUCTOR: Inductors Basic Inductor/Choke - 0603 and 1206. Footprints are not proven and vary greatly between part numbers.; PARTNO: CDRH2D09NP-4R7MC
LD1 LD2 LD100-LD122 = led:LED: LED OSRAM: - CHIPLED LG R971, LG N971, LY N971, LG Q971, LY Q971, LO R971, LY R971 LH N974, LH R974 LS Q976, LO Q976, LY Q976 LO Q996 - Hyper CHIPLED LW Q18S LB Q993, LB Q99A, LB R99A - SideLED LS A670, LO A670, LY A670, LG A670, LP A670 LB A673, LV A673, LT A673, LW A673 LH A674 LY A675 LS A676, LA A676, LO A676, LY A676, LW A676 LS A679, LY A679, LG A679 - Hyper Micro SIDELED® LS Y876, LA Y876, LO Y876, LY Y876 LT Y87S - SmartLED LW L88C, LW L88S LB L89C, LB L89S, LG L890 LS L89K, LO L89K, LY L89K LS L896, LA L896, LO L896, LY L896 - TOPLED LS T670, LO T670, LY T670, LG T670, LP T670 LSG T670, LSP T670, LSY T670, LOP T670, LYG T670 LG T671, LOG T671, LSG T671 LB T673, LV T673, LT T673, LW T673 LH T674 LS T676, LA T676, LO T676, LY T676, LB T676, LH T676, LSB T676, LW T676 LB T67C, LV T67C, LT T67C, LS T67K, LO T67K, LY T67K, LW E67C LS E67B, LA E67B, LO E67B, LY E67B, LB E67C, LV E67C, LT E67C LW T67C LS T679, LY T679, LG T679 LS T770, LO T770, LY T770, LG T770, LP T770 LB T773, LV T773, LT T773, LW T773 LH T774 LS E675, LA E675, LY E675, LS T675 LS T776, LA T776, LO T776, LY T776, LB T776 LHGB T686 LT T68C, LB T68C - Hyper Mini TOPLED® LB M676 - Mini TOPLED Santana® LG M470 LS M47K, LO M47K, LY M47K Source: http://www.osram.convergy.de LUXEON: - LUMILED® LXK2-PW12-R00, LXK2-PW12-S00, LXK2-PW14-U00, LXK2-PW14-V00 LXK2-PM12-R00, LXK2-PM12-S00, LXK2-PM14-U00 LXK2-PE12-Q00, LXK2-PE12-R00, LXK2-PE12-S00, LXK2-PE14-T00, LXK2-PE14-U00 LXK2-PB12-K00, LXK2-PB12-L00, LXK2-PB12-M00, LXK2-PB14-N00, LXK2-PB14-P00, LXK2-PB14-Q00 LXK2-PR12-L00, LXK2-PR12-M00, LXK2-PR14-Q00, LXK2-PR14-R00 LXK2-PD12-Q00, LXK2-PD12-R00, LXK2-PD12-S00 LXK2-PH12-R00, LXK2-PH12-S00 LXK2-PL12-P00, LXK2-PL12-Q00, LXK2-PL12-R00 Source: www.luxeon.com KINGBRIGHT: KA-3528ASYC Source: www.kingbright.com; PARTNO: LG R971-KN-1-0-20-R18
LD3 = led:LED: LED OSRAM: - CHIPLED LG R971, LG N971, LY N971, LG Q971, LY Q971, LO R971, LY R971 LH N974, LH R974 LS Q976, LO Q976, LY Q976 LO Q996 - Hyper CHIPLED LW Q18S LB Q993, LB Q99A, LB R99A - SideLED LS A670, LO A670, LY A670, LG A670, LP A670 LB A673, LV A673, LT A673, LW A673 LH A674 LY A675 LS A676, LA A676, LO A676, LY A676, LW A676 LS A679, LY A679, LG A679 - Hyper Micro SIDELED® LS Y876, LA Y876, LO Y876, LY Y876 LT Y87S - SmartLED LW L88C, LW L88S LB L89C, LB L89S, LG L890 LS L89K, LO L89K, LY L89K LS L896, LA L896, LO L896, LY L896 - TOPLED LS T670, LO T670, LY T670, LG T670, LP T670 LSG T670, LSP T670, LSY T670, LOP T670, LYG T670 LG T671, LOG T671, LSG T671 LB T673, LV T673, LT T673, LW T673 LH T674 LS T676, LA T676, LO T676, LY T676, LB T676, LH T676, LSB T676, LW T676 LB T67C, LV T67C, LT T67C, LS T67K, LO T67K, LY T67K, LW E67C LS E67B, LA E67B, LO E67B, LY E67B, LB E67C, LV E67C, LT E67C LW T67C LS T679, LY T679, LG T679 LS T770, LO T770, LY T770, LG T770, LP T770 LB T773, LV T773, LT T773, LW T773 LH T774 LS E675, LA E675, LY E675, LS T675 LS T776, LA T776, LO T776, LY T776, LB T776 LHGB T686 LT T68C, LB T68C - Hyper Mini TOPLED® LB M676 - Mini TOPLED Santana® LG M470 LS M47K, LO M47K, LY M47K Source: http://www.osram.convergy.de LUXEON: - LUMILED® LXK2-PW12-R00, LXK2-PW12-S00, LXK2-PW14-U00, LXK2-PW14-V00 LXK2-PM12-R00, LXK2-PM12-S00, LXK2-PM14-U00 LXK2-PE12-Q00, LXK2-PE12-R00, LXK2-PE12-S00, LXK2-PE14-T00, LXK2-PE14-U00 LXK2-PB12-K00, LXK2-PB12-L00, LXK2-PB12-M00, LXK2-PB14-N00, LXK2-PB14-P00, LXK2-PB14-Q00 LXK2-PR12-L00, LXK2-PR12-M00, LXK2-PR14-Q00, LXK2-PR14-R00 LXK2-PD12-Q00, LXK2-PD12-R00, LXK2-PD12-S00 LXK2-PH12-R00, LXK2-PH12-S00 LXK2-PL12-P00, LXK2-PL12-Q00, LXK2-PL12-R00 Source: www.luxeon.com KINGBRIGHT: KA-3528ASYC Source: www.kingbright.com; PARTNO: APT2012YC
MN1-MN3 = SmartPrj:FIDUCIALMOUNT; BOM: EXCLUDE
Q1 = mpf:NPN_PNPSM8: Dual NPN PNP TRANSISTOR; PARTNO: DMG264060R
Q2 = transistor-small-signal:2SC4726: High-Frequency Amplifier Transistor 11V, 50mA, 3.2GHz (Rohm); PARTNO: MMBT3904TT1G
R1 R16 R60 = resistor:R-US_: RESISTOR, American symbol; PARTNO: RC0603JR-0710KL
R2-R4 R7 R9 R13 R14 = resistor:R-US_: RESISTOR, American symbol; PARTNO: RC0603JR-07220KL
R5 R8 R12 R46 R55 R100 R101 R105 R106 R108 R109 R112 R113 R116-R129 = resistor:R-US_: RESISTOR, American symbol; PARTNO: RC0603JR-07470RL
R6 = resistor:R-US_: RESISTOR, American symbol; PARTNO: RC0603JR-072ML
R10 = resistor:R-US_: RESISTOR, American symbol; PARTNO: RC0603JR-072KL
R11 = resistor:R-US_: RESISTOR, American symbol; PARTNO: CRCW04021M20FKED
R15 R17-R20 R28-R33 R36 R39 R41 R42 R44 R47 R50-R52 R54 R56-R58 R63 R102-R104 R107 R110 R111 R114 R115 = resistor:R-US_: RESISTOR, American symbol; PARTNO: RC0603JR-07100KL
R21 R26 = resistor:R-US_: RESISTOR, American symbol; PARTNO: RC0603JR-0720RL
R22 = resistor:R-US_: RESISTOR, American symbol; PARTNO: ERJ-3EKF27R0V
R23 R24 R35 R37 R43 R48 = resistor:R-US_: RESISTOR, American symbol; PARTNO: RC0603JR-071ML
R25 = resistor:R-US_: RESISTOR, American symbol; PARTNO: RC0603JR-0710RL
R27 R34 R49 = resistor:R-US_: RESISTOR, American symbol; PARTNO: RC0603JR-071KL
R38 R61 = resistor:R-US_: RESISTOR, American symbol; PARTNO: ERJ-3EKF4992V
R40 R53 = resistor:R-US_: RESISTOR, American symbol; PARTNO: RC0603JR-070RL
R45 = resistor:R-US_: RESISTOR, American symbol; PARTNO: RC0603JR-0710ML
R59 R62 = resistor:R-US_: RESISTOR, American symbol; DNP: T; PARTNO: RC0603JR-070RL
S100-S108 = mpf:TAC_SWITCH: Momentary Switch Button commonly used for reset or general input. Spark Fun Electronics SKU : COM-00097; PARTNO: TL3301PF160QG
TP1 = SparkFun:TEST-POINT; DNP: T
TP2 TP4 TP13 TP15 = pinhead:PINHD-1X1: PIN HEADER; DNP: T; SIGNAL: GND
TP3 TP9 TP14 = pinhead:PINHD-1X1: PIN HEADER; DNP: T; SIGNAL: 3.3V
TP5 = pinhead:PINHD-1X1: PIN HEADER; DNP: T; SIGNAL: MOSI
TP6 = pinhead:PINHD-1X1: PIN HEADER; DNP: T; SIGNAL: SCK
TP7 = pinhead:PINHD-1X1: PIN HEADER; DNP: T; SIGNAL: MISO
TP8 = pinhead:PINHD-1X1: PIN HEADER; DNP: T; SIGNAL: SCL
TP10 = pinhead:PINHD-1X1: PIN HEADER; DNP: T; SIGNAL: SDA
TP11 = pinhead:PINHD-1X1: PIN HEADER; DNP: T; SIGNAL: RESET
TP12 = pinhead:PINHD-1X1: PIN HEADER; DNP: T; SIGNAL: 1.8V
U1 = SparkFun:TPS61200: DC to DC Booster; PARTNO: TPS61200DRCT
U2 = ScratchPad:BLUETOOTH-RN41; PARTNO: RN-42
U3 = mpf:ATMEGA2560: MICROCONTROLLER 64/128/256 Kbytes FLASH 4 Kbytes EEPROM 8 Kbytes SRAM 86 General Purpose I/O pins 12-channels16-bit PWM 4 x Serial USARTs 16-channels 10-bit A/D; PARTNO: ATMEGA2560-16AU
U4 = SparkFun:VS1033; PARTNO: VS1053B-L
U5 = SparkFun:V_REG_LDO: Voltage Regulator LDO Standard 150mA LDO voltage regulator in SOT-23 layout. Micrel part MIC5205. BP (by-pass) pin is used to lower output noise with 470pF cap.; PARTNO: MIC5365-1.8YC5
U6 U10 = mpf:MCP6S21: The Microchip Technology Inc. MCP6S21/2/6/8 are analog Programmable Gain Amplifiers (PGA). They can be configured for gains from +1 V/V to +32 V/V and the input multiplexer can select one of up to eight channels through an SPI port. The serial interface can also put the PGA into shutdown to conserve power. These PGAs are optimized for high speed, low offset voltage and single-supply operation with rail-to-rail input and output capability. These specifications support single supply applications needing flexible performance or multiple inputs.; PARTNO: MCP6S21-I/SN
U7 U8 = mpf:MCP4013: 2-Wire Digital Potentiometer Microchip; http://www.microchip.com/; PARTNO: MCP4013T-103E/CH
U9 U12 = mpf:INA826: Instrumentation Amplifier Precision, Low Power; PARTNO: INA826AIDGKR
U11 = mpf:TPA6100: 50-mW ULTRALOW VOLTAGE STEREO HEADPHONE AUDIO POWER AMPLIFIER; PARTNO: TPA6100A2DR
X1 = SmartPrj:RESONATOR; PARTNO: AWSCR-16.00CV-T; PLACE: POP X2 OR X3
X2 = special:XTAL/S: CRYSTAL; PARTNO: ATS16B; PLACE: POP X2 OR X3
X3 = SparkFun:CRYSTAL: Crystals Various standard crystals. Proven footprints. Spark Fun Electronics SKU : COM-00534; PARTNO: ATS122B
X4 = mpf:XTAL/S: CRYSTAL; PARTNO: ATS16B
Z1-Z4 = varistor:VARISTOR: VARISTOR; PARTNO: PGB1010603MR

## Net classes
0 default: width 0.178 mm
1 power: width 0.254 mm
2 VIN: width 0.406 mm
3 3.3V: width 0.254 mm
4 1.8V: width 0.254 mm